# EAGLE design INA219 (EAGLE 6.2)
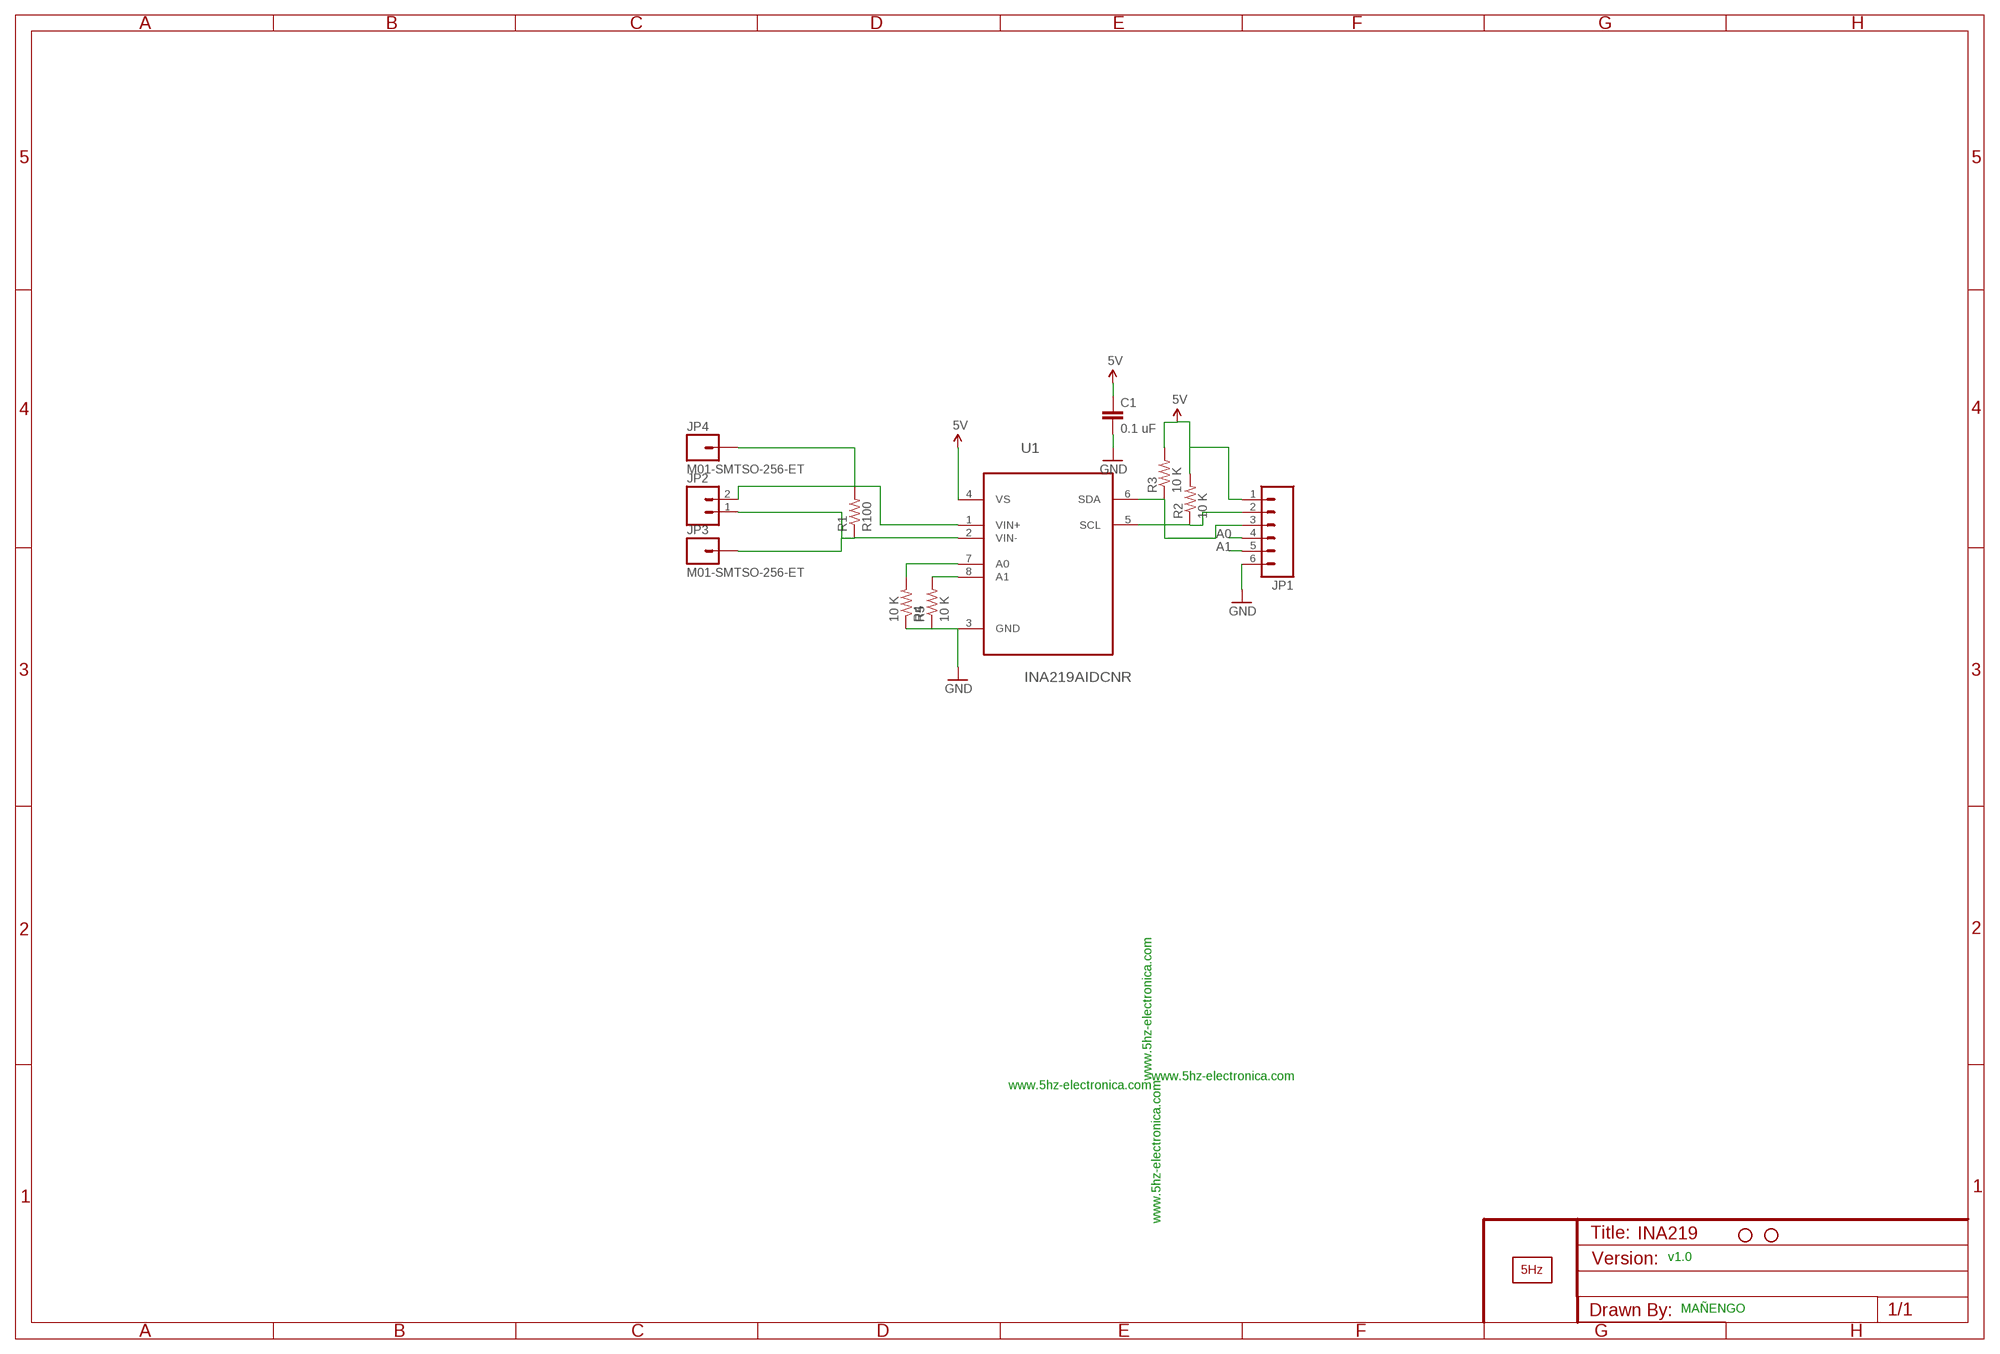
[diagram p0: schematic, sheet 1]

## Parts
C1  0.1 uF  CAP0603-CAP  [0603-CAP]
JP1  M06SIP  [1X06]
JP2  M023.5MM-NO_SILK  [SCREWTERMINAL-3.5MM-2-NS]
JP3  M01-SMTSO-256-ET  [SMTSO-256-ET]
JP4  M01-SMTSO-256-ET  [SMTSO-256-ET]
JP5  STAND-OFF  [STAND-OFF]
JP6  STAND-OFF  [STAND-OFF]
R1  R100  RESISTOR2512  [R2512]
R2  10 K  RESISTOR0603-RES  [0603-RES]
R3  10 K  RESISTOR0603-RES  [0603-RES]
R4  10 K  RESISTOR0603-RES  [0603-RES]
R5  10 K  RESISTOR0603-RES  [0603-RES]
U1  INA219AIDCNR  [SOT65P280X145-8N]
U$5  LOGO2_SILK5MM  [LOGO2_5MM]

## Nets
5V: C1.1 JP1.1 R2.2 R3.2 U1.4(VS)
A0: JP1.4 R4.2 U1.7(A0)
A1: JP1.5 R5.2 U1.8(A1)
GND: C1.2 JP1.6 R4.1 R5.1 U1.3(GND)
N$1: JP2.2 JP4.P$1 R1.2 U1.1(VIN+)
N$2: JP2.1 JP3.P$1 R1.1 U1.2(VIN-)
SCL: JP1.2 R2.1 U1.5(SCL)
SDA: JP1.3 R3.1 U1.6(SDA)

## Notes on the sheet
- www.5hz-electronica.com | www.5hz-electronica.com | www.5hz-electronica.com | www.5hz-electronica.com
- v1.0
- MAÑENGO

## Library data of the parts
C1 = SparkFun:CAP: Capacitor Standard 0603 ceramic capacitor, and 0.1" leaded capacitor.
JP1 = SparkFun:M06: Header 6 Standard 6-pin 0.1" header. Use with straight break away headers (SKU : PRT-00116), right angle break away headers (PRT-00553), swiss pins (PRT-00743), machine pins (PRT-00117), and female headers (PRT-00115). Molex polarized connector foot print use with SKU : PRT-08094 with associated crimp pins and housings. NOTES ON THE VARIANTS LOCK and LOCK_LONGPADS... This footprint was designed to help hold the alignment of a through-hole component (i.e. 6-pin header) while soldering it into place. You may notice that each hole has been shifted either up or down by 0.005 of an inch from it's more standard position (which is a perfectly straight line). This slight alteration caused the pins (the squares in the middle) to touch the edges of the holes. Because they are alternating, it causes a "brace" to hold the component in place. 0.005 has proven to be the perfect amount of "off-center" position when using our standard breakaway headers. Although looks a little odd when you look at the bare footprint, once you have a header in there, the alteration is very hard to notice. Also, if you push a header all the way into place, it is covered up entirely on the bottom side. This idea of altering the position of holes to aid alignment will be further integrated into the Sparkfun Library for other footprints. It can help hold any component with 3 or more connection pins.
JP2 = SparkFun:M02: Header 2 Standard 2-pin 0.1" header. Use with straight break away headers (SKU : PRT-00116), right angle break away headers (PRT-00553), swiss pins (PRT-00743), machine pins (PRT-00117), and female headers (PRT-00115). Molex polarized connector foot print use with SKU : PRT-08233 with associated crimp pins and housings.
JP3 JP4 = SparkFun:M01: Header 1 Standard 1-pin 0.1" header. Use with straight break away headers (SKU : PRT-00116), right angle break away headers (PRT-00553), swiss pins (PRT-00743), machine pins (PRT-00117), and female headers (PRT-00115).
JP5 JP6 = SparkFun:STAND-OFF: Stand Off This is the mechanical footprint for a #4 phillips button head screw. Use the keepout ring to avoid running the screw head into surrounding components. SKU : PRT-00447
R1-R5 = SparkFun:RESISTOR: Resistor Basic schematic elements and footprints for 0603, 1206, and PTH resistors.
U1 = INA219:INA219AIDCNR: CURRENT/POWER MONITOR; MPN: INA219AIDCNR; OC_FARNELL: 1682558; OC_NEWARK: 09P2546; PACKAGE: SOT-23-8; SUPPLIER: Texas Instruments
U$5 = LOGO:LOGO2_SILK: PRINCIPAL

## Board
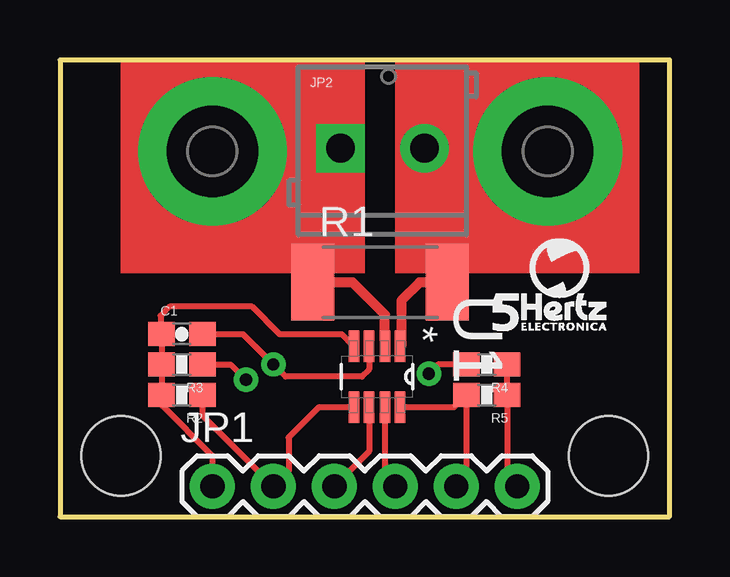
[diagram p1: board, top side]
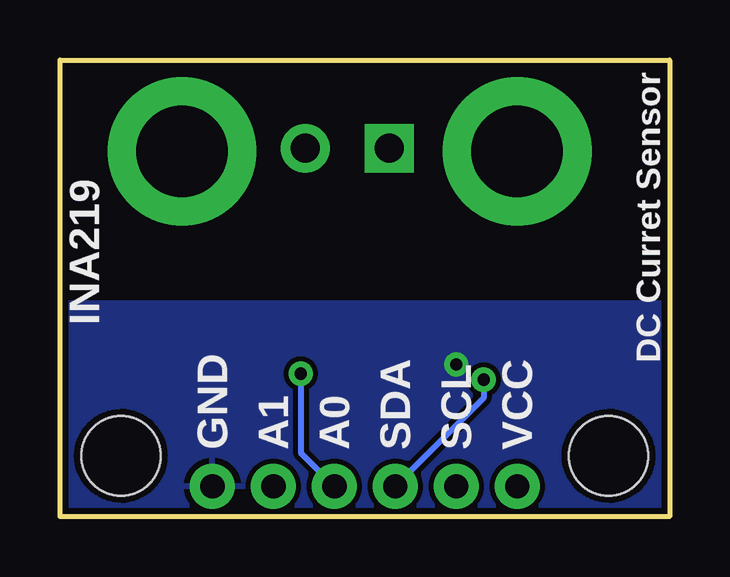
[diagram p2: board, bottom side, seen from below]

Size 25.4 x 19.05 mm. Coordinates in mm from the lower left corner, seen from the top.
Outline: 0,0 25.4,0 25.4,19.05 0,19.05 0,0
Copper layers (1*16): Top 0.035mm / dielectric 1.5mm / Bottom 0.035mm
Design rules: minimum track width 8mil, minimum drill 20mil, track to track 8mil, track to pad 8mil, pad to pad 8mil, via to via 8mil, smd to smd 8mil, copper to edge 10mil, drill to drill 8mil, minimum pad ring 12mil, minimum via ring 10mil, stop-mask expansion 4mil, vias tented up to drill 25mil, thermal gap 10mil

### Footprints (pad centres in the part's own frame; a part is rotated, then mirrored left to right if it is on the bottom)
0603-CAP = smd 1.1 x 1: 1 -0.85,0; 2 0.85,0
1X06 = drill 1.016 pad 1.88: 1 0,0; 2 2.54,0; 3 5.08,0; 4 7.62,0; 5 10.16,0; 6 12.7,0
SCREWTERMINAL-3.5MM-2-NS = drill 1.2 pad 2.032 square: 1 0,0 | drill 1.2 pad 2.032: 2 3.5,0
SMTSO-256-ET = drill 3.81 pad 6.198: P$1 0,0
STAND-OFF = hole 3.302: 0,0
R2512 = smd 1.8 x 3.2: 1 -2.8,0; 2 2.8,0
0603-RES = smd 1.1 x 1: 1 -0.85,0; 2 0.85,0
SOT65P280X145-8N = smd 1.321 x 0.432: 1 -1.27,0.965; 2 -1.27,0.33; 3 -1.27,-0.33; 4 -1.27,-0.965; 5 1.27,-0.965; 6 1.27,-0.33; 7 1.27,0.33; 8 1.27,0.965

### Placement (x,y rotation side)
C1  5.08,7.62 0 top
JP1  6.35,1.27 0 top
JP2  11.68,15.37 0 top
JP3  6.35,15.24 0 top
JP4  20.32,15.24 0 top
JP5  22.86,2.54 0 top
JP6  2.54,2.54 0 top
R1  13.34,9.78 0 top
R2  5.08,5.08 180 top
R3  5.08,6.35 180 top
R4  17.78,6.35 180 top
R5  17.78,5.08 180 top
U1  13.21,5.84 270 top
U$5  18.03,7.75 0 top

### Tracks (layer width: path | path; a pad name or v marks a point on that pad's centre or on a via)
5V
  Top 0.254: R3.2 R2.2 | R2.2 C1.1 4.19,7.66 4.19,8.38 4.57,8.76 8,8.76 9.14,7.62 11.73,7.62 U1.4 | R2.2 4.06,4.91 4.23,4.91 4.23,4.66 6.35,2.54 JP1.1
A0  (via drill 0.51)
  Top 0.254: U1.7 13.54,1.7 JP1.4 | R4.2 15.75,6.35 v15.37,5.97
  Bottom 0.254: v15.37,5.97 15.37,2.67 JP1.4
A1
  Top 0.254: U1.8 16.42,4.57 R5.2 16.93,1.49 JP1.5
GND  (via drill 0.51)
  Top 0.254: R4.1 R5.1 18.63,1.69 JP1.6 | C1.2 7.62,7.62 v8.89,6.35 9.4,5.84 12.57,5.84 12.88,6.15 U1.3
  pour Bottom: 0,8.89 25.4,8.89 25.4,0 0,0
N$1
  Top 0.254: JP4.P$1 15.31,15.24 JP2.2 15.18,10.73 R1.2 | 14.22,7.16 U1.1
  Top 0.406: R1.2 14.99,9.78 14.22,9.02 14.22,7.16
N$2
  Top 0.254: JP3.P$1 11.56,15.24 JP2.1 11.68,12.19 10.29,10.79 10.29,10.03 R1.1
  Top 0.406: U1.2 13.54,8.43 12.19,9.78 R1.1
SCL
  Top 0.254: U1.5 10.79,4.57 9.53,3.3 9.53,1.91 JP1.2 5.93,4.23 R2.1
SDA  (via drill 0.51)
  Top 0.254: U1.6 12.88,2.72 JP1.3 | R3.1 7.11,6.35 v7.75,5.71
  Bottom 0.254: v7.75,5.71 7.75,4.95 JP1.3
(copper drawn outside any net)
  shapes: Top area x2

### Text on the board
bPlace: DC Curret Sensor | INA219 | VCC | SCL | SDA | A0 | A1 | GND